# EAGLE design Teensy-FC-BOB (EAGLE 7.4.0)
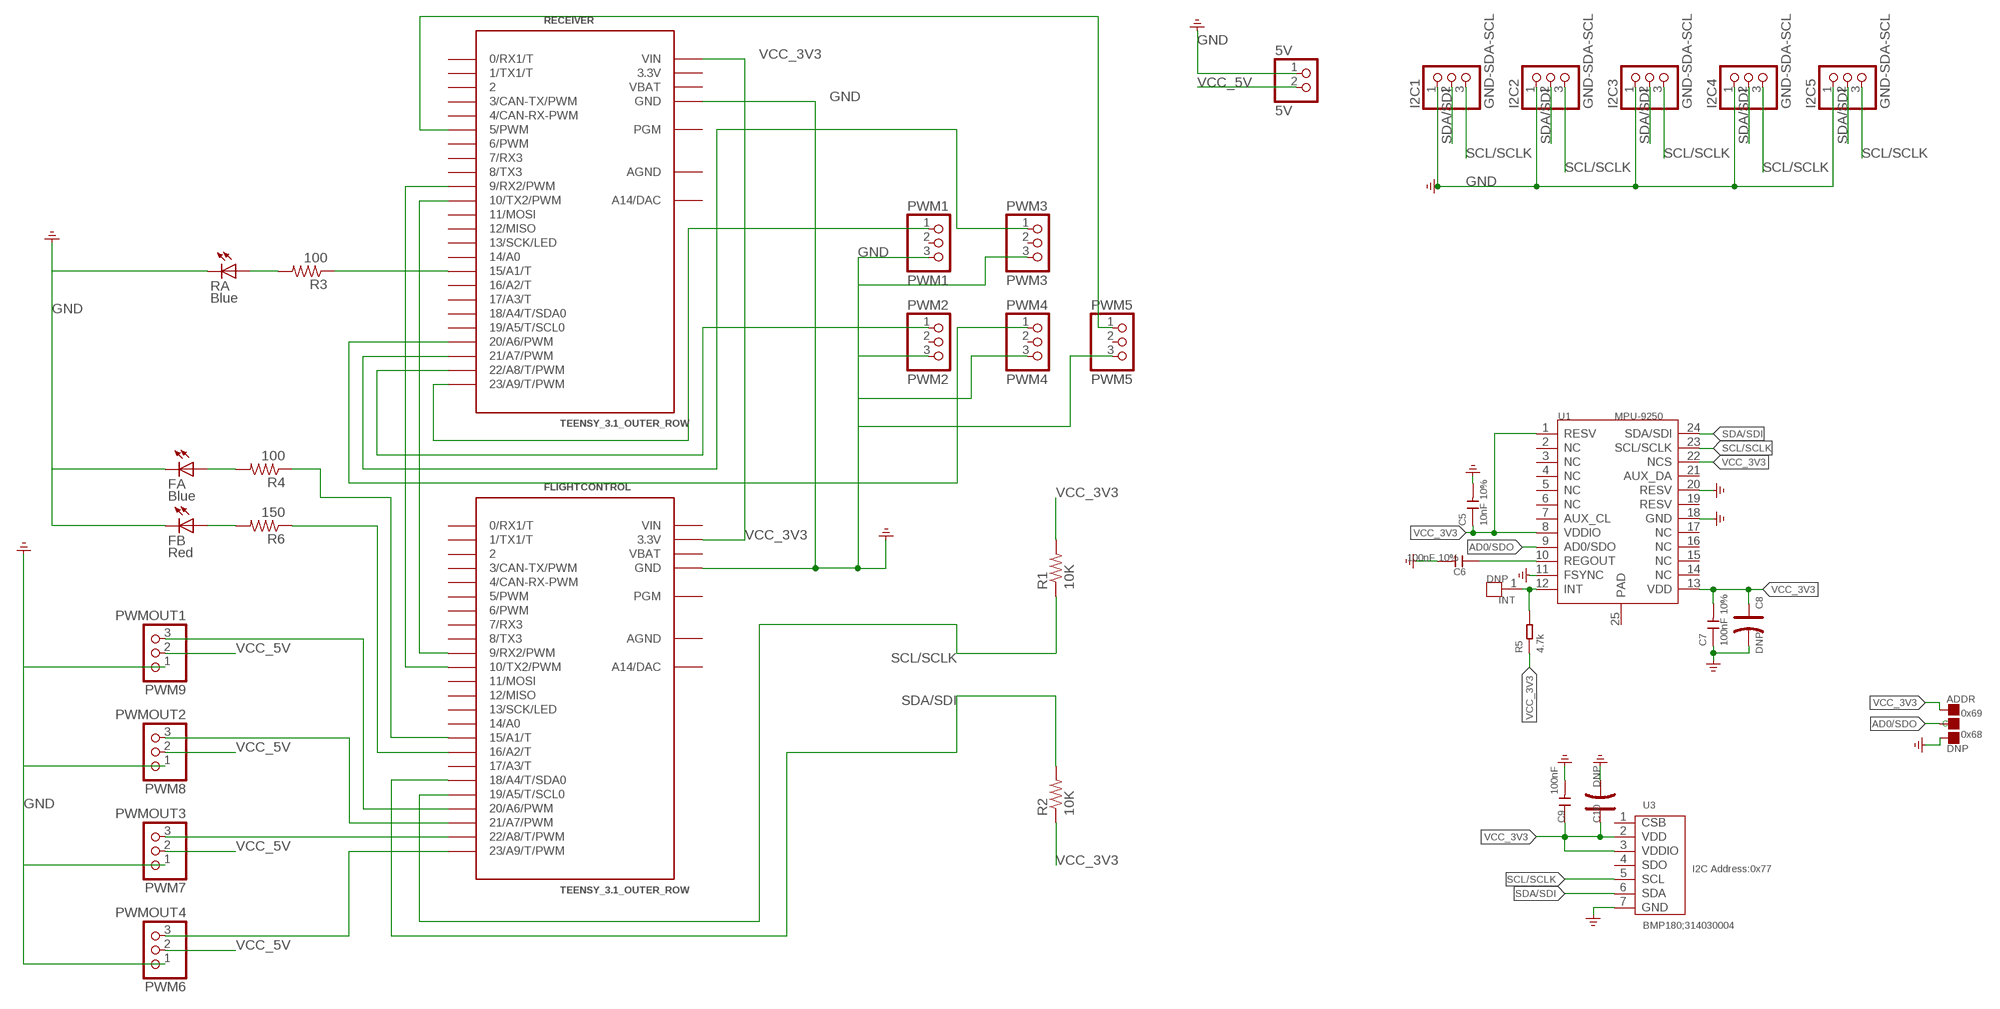
[diagram p0: schematic, sheet 1]

## Parts
5V  5V  PINHD-1X2  [1X02]
ADDR  DNP  PAD-JUMPER-3P-40*40  [3P-SMD-L4.1*W1.5MM]
C5  10nF 10%  CAP-0603  [C0603]
C6  100nF 10%  CAP-0603  [C0603]
C7  100nF 10%  CAP-0603  [C0603]
C8  DNP  CAP-POLAR-AVX-A  [AVX-A]
C9  100nF  CAP-0603  [C0603]
C10  DNP  CAP-POLAR-AVX-A  [AVX-A]
FA  Blue  LEDCHIP-LED0603  [CHIP-LED0603]
FB  Red  LEDCHIP-LED0603  [CHIP-LED0603]
FLIGHTCONTROL  TEENSY_3.1_OUTER_ROW  [TEENSY3-OUTER_ROW]
I2C1  GND-SDA-SCL  PINHD-1X3  [1X03]
I2C2  GND-SDA-SCL  PINHD-1X3  [1X03]
I2C3  GND-SDA-SCL  PINHD-1X3  [1X03]
I2C4  GND-SDA-SCL  PINHD-1X3  [1X03]
I2C5  GND-SDA-SCL  PINHD-1X3  [1X03]
INT  DNP  HEADER-1P-35  [1P-65/35MIL]
PWM1  PWM1  PINHD-1X3  [1X03]
PWM2  PWM2  PINHD-1X3  [1X03]
PWM3  PWM3  PINHD-1X3  [1X03]
PWM4  PWM4  PINHD-1X3  [1X03]
PWM5  PWM5  PINHD-1X3  [1X03]
PWM6  PWMOUT4  PINHD-1X3  [1X03]
PWM7  PWMOUT3  PINHD-1X3  [1X03]
PWM8  PWMOUT2  PINHD-1X3  [1X03]
PWM9  PWMOUT1  PINHD-1X3  [1X03]
R1  10K  R-US_R0603  [R0603]
R2  10K  R-US_R0603  [R0603]
R3  100  R-US_R0603  [R0603]
R4  100  R-US_R0603  [R0603]
R5  4.7k  RES-0603  [R0603]
R6  150  R-US_R0603  [R0603]
RA  Blue  LEDCHIP-LED0603  [CHIP-LED0603]
RECEIVER  TEENSY_3.1_OUTER_ROW  [TEENSY3-OUTER_ROW]
U1  MPU-9250  [LEAD-QFN24]
U3  BMP180;314030004  BMP180  [LGA-7]

## Nets
AD0/SDO: ADDR.MM(C) U1.9(AD0/SDO)
GND: 5V.1 ADDR.11(R) C5.2 C6.2 C7.1 C8.- C9.2 C10.- FA.C FB.C FLIGHTCONTROL.GND FLIGHTCONTROL.GND1(GND) I2C1.1 I2C2.1 I2C3.1 I2C4.1 I2C5.1 PWM1.3 PWM2.3 PWM3.3 PWM4.3 PWM5.3 PWM6.1 PWM7.1 PWM8.1 PWM9.1 RA.C RECEIVER.GND RECEIVER.GND1(GND) U1.11(FSYNC) U1.18(GND) U1.20(RESV) U3.7(GND) ; supply symbol labelled GND_POWER
N$1: FLIGHTCONTROL.9(9/RX2/PWM) RECEIVER.10(10/TX2/PWM)
N$2: FLIGHTCONTROL.10(10/TX2/PWM) RECEIVER.9(9/RX2/PWM)
N$3: C6.1 U1.10(REGOUT)
N$4: INT.1 R5.2 U1.12(INT)
N$5: PWM1.1 RECEIVER.23/A9(23/A9/T/PWM)
N$6: PWM2.1 RECEIVER.22/A8(22/A8/T/PWM)
N$7: PWM3.1 RECEIVER.21/A7(21/A7/PWM)
N$8: PWM4.1 RECEIVER.20/A6(20/A6/PWM)
N$9: PWM5.1 RECEIVER.5(5/PWM)
N$10: FLIGHTCONTROL.20/A6(20/A6/PWM) PWM9.3
N$11: FLIGHTCONTROL.21/A7(21/A7/PWM) PWM8.3
N$12: FLIGHTCONTROL.22/A8(22/A8/T/PWM) PWM7.3
N$13: FLIGHTCONTROL.23/A9(23/A9/T/PWM) PWM6.3
N$14: FLIGHTCONTROL.15/A1(15/A1/T) R4.1
N$15: FA.A R4.2
N$16: R3.1 RECEIVER.15/A1(15/A1/T)
N$17: R3.2 RA.A
N$18: FLIGHTCONTROL.16/A2(16/A2/T) R6.1
N$19: FB.A R6.2
SCL/SCLK: FLIGHTCONTROL.19/A5(19/A5/T/SCL0) I2C1.3 I2C2.3 I2C3.3 I2C4.3 I2C5.3 R1.1 U1.23(SCL/SCLK) U3.5(SCL)
SDA/SDI: FLIGHTCONTROL.18/A4(18/A4/T/SDA0) I2C1.2 I2C2.2 I2C3.2 I2C4.2 I2C5.2 R2.2 U1.24(SDA/SDI) U3.6(SDA)
VCC_3V3: ADDR.00(L) C5.1 C7.2 C8.+ C9.1 C10.+ FLIGHTCONTROL.3.3V FLIGHTCONTROL.3.3V1(3.3V) R1.2 R2.1 R5.1 RECEIVER.VIN U1.1(RESV) U1.8(VDDIO) U1.13(VDD) U1.22(NCS) U3.2(VDD) U3.3(VDDIO)
VCC_5V: 5V.2 PWM6.2 PWM7.2 PWM8.2 PWM9.2
Unconnected: FLIGHTCONTROL.0(0/RX1/T) FLIGHTCONTROL.1(1/TX1/T) FLIGHTCONTROL.2 FLIGHTCONTROL.3(3/CAN-TX/PWM) FLIGHTCONTROL.4(4/CAN-RX-PWM) FLIGHTCONTROL.5(5/PWM) FLIGHTCONTROL.6(6/PWM) FLIGHTCONTROL.7(7/RX3) FLIGHTCONTROL.8(8/TX3) FLIGHTCONTROL.11(11/MOSI) FLIGHTCONTROL.12(12/MISO) FLIGHTCONTROL.13(13/SCK/LED) FLIGHTCONTROL.14/A0 FLIGHTCONTROL.17/A3(17/A3/T) FLIGHTCONTROL.PGM FLIGHTCONTROL.RESET/DAC(A14/DAC) PWM1.2 PWM2.2 PWM3.2 PWM4.2 PWM5.2 RECEIVER.0(0/RX1/T) RECEIVER.1(1/TX1/T) RECEIVER.2 RECEIVER.3(3/CAN-TX/PWM) RECEIVER.4(4/CAN-RX-PWM) RECEIVER.6(6/PWM) RECEIVER.7(7/RX3) RECEIVER.8(8/TX3) RECEIVER.11(11/MOSI) RECEIVER.12(12/MISO) RECEIVER.13(13/SCK/LED) RECEIVER.14/A0 RECEIVER.16/A2(16/A2/T) RECEIVER.17/A3(17/A3/T) RECEIVER.18/A4(18/A4/T/SDA0) RECEIVER.19/A5(19/A5/T/SCL0) RECEIVER.PGM RECEIVER.RESET/DAC(A14/DAC) U1.2(NC) U1.3(NC) U1.4(NC) U1.5(NC) U1.6(NC) U1.7(AUX_CL) U1.14(NC) U1.15(NC) U1.16(NC) U1.17(NC) U1.19(RESV) U1.21(AUX_DA) U1.25(PAD) U3.1(CSB) U3.4(SDO)

## Notes on the sheet
- 0x69
- 0x68
- I2C Address:0x77

## Power pins joined to a net without a drawn wire
3.3V: RECEIVER.3.3V RECEIVER.3.3V1(3.3V)
AGND: FLIGHTCONTROL.AGND RECEIVER.AGND
VBAT: FLIGHTCONTROL.VBAT RECEIVER.VBAT
VIN: FLIGHTCONTROL.VIN

## Library data of the parts
5V = pinhead:PINHD-1X2: PIN HEADER
ADDR = Discrete-new:PAD-JUMPER-3P; PARTNO: DNP
C5-C7 C9 = Discrete-new:CAP: Ceramic Capacitors
C8 C10 = Discrete-new:CAP-POLAR: Electrolytic Capacitors,Tantalum Capacitors and Super Capacitors
FA FB RA = led:LED: LED OSRAM: - CHIPLED LG R971, LG N971, LY N971, LG Q971, LY Q971, LO R971, LY R971 LH N974, LH R974 LS Q976, LO Q976, LY Q976 LO Q996 - Hyper CHIPLED LW Q18S LB Q993, LB Q99A, LB R99A - SideLED LS A670, LO A670, LY A670, LG A670, LP A670 LB A673, LV A673, LT A673, LW A673 LH A674 LY A675 LS A676, LA A676, LO A676, LY A676, LW A676 LS A679, LY A679, LG A679 - Hyper Micro SIDELED® LS Y876, LA Y876, LO Y876, LY Y876 LT Y87S - SmartLED LW L88C, LW L88S LB L89C, LB L89S, LG L890 LS L89K, LO L89K, LY L89K LS L896, LA L896, LO L896, LY L896 - TOPLED LS T670, LO T670, LY T670, LG T670, LP T670 LSG T670, LSP T670, LSY T670, LOP T670, LYG T670 LG T671, LOG T671, LSG T671 LB T673, LV T673, LT T673, LW T673 LH T674 LS T676, LA T676, LO T676, LY T676, LB T676, LH T676, LSB T676, LW T676 LB T67C, LV T67C, LT T67C, LS T67K, LO T67K, LY T67K, LW E67C LS E67B, LA E67B, LO E67B, LY E67B, LB E67C, LV E67C, LT E67C LW T67C LS T679, LY T679, LG T679 LS T770, LO T770, LY T770, LG T770, LP T770 LB T773, LV T773, LT T773, LW T773 LH T774 LS E675, LA E675, LY E675, LS T675 LS T776, LA T776, LO T776, LY T776, LB T776 LHGB T686 LT T68C, LB T68C - Hyper Mini TOPLED® LB M676 - Mini TOPLED Santana® LG M470 LS M47K, LO M47K, LY M47K Source: http://www.osram.convergy.de LUXEON: - LUMILED® LXK2-PW12-R00, LXK2-PW12-S00, LXK2-PW14-U00, LXK2-PW14-V00 LXK2-PM12-R00, LXK2-PM12-S00, LXK2-PM14-U00 LXK2-PE12-Q00, LXK2-PE12-R00, LXK2-PE12-S00, LXK2-PE14-T00, LXK2-PE14-U00 LXK2-PB12-K00, LXK2-PB12-L00, LXK2-PB12-M00, LXK2-PB14-N00, LXK2-PB14-P00, LXK2-PB14-Q00 LXK2-PR12-L00, LXK2-PR12-M00, LXK2-PR14-Q00, LXK2-PR14-R00 LXK2-PD12-Q00, LXK2-PD12-R00, LXK2-PD12-S00 LXK2-PH12-R00, LXK2-PH12-S00 LXK2-PL12-P00, LXK2-PL12-Q00, LXK2-PL12-R00 Source: www.luxeon.com KINGBRIGHT: KA-3528ASYC Source: www.kingbright.com
FLIGHTCONTROL RECEIVER = Teensy_3_and_LC_Series_Boards_v1.0:TEENSY_3.1_OUTER_ROW: Footprint for Teensy 3.1 or 3.2 board using all pin connections on the outer perimeter
I2C1-I2C5 PWM1-PWM9 = pinhead:PINHD-1X3: PIN HEADER
INT = Connector-new:HEADER-1P
R1-R4 R6 = resistor:R-US_: RESISTOR, American symbol
R5 = Discrete-new:RES
U1 = template:MPU-9250
U3 = template:BMP180: Digital pressure sensor

## Board
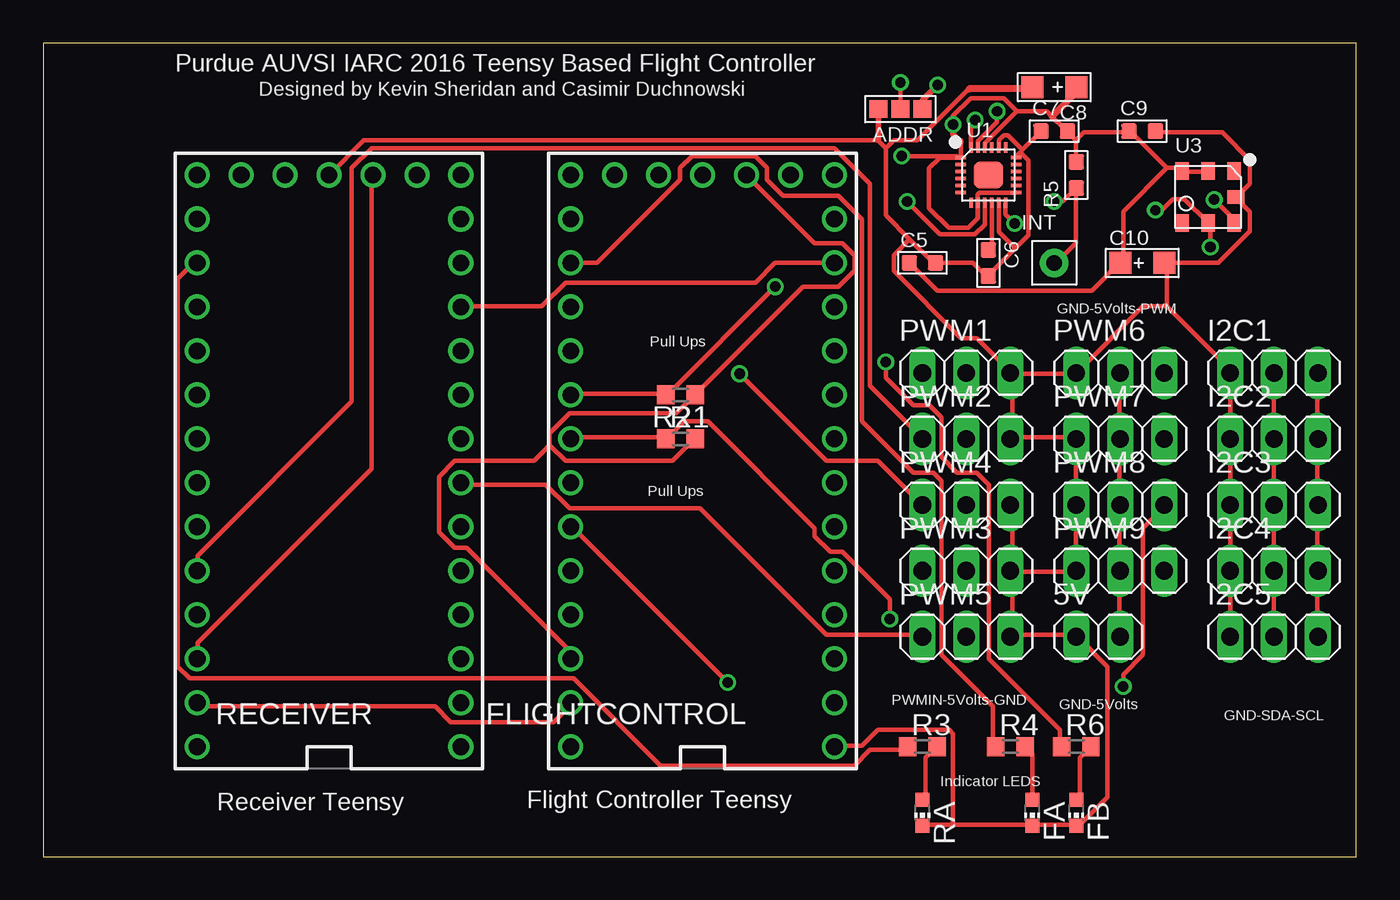
[diagram p1: board, top side]
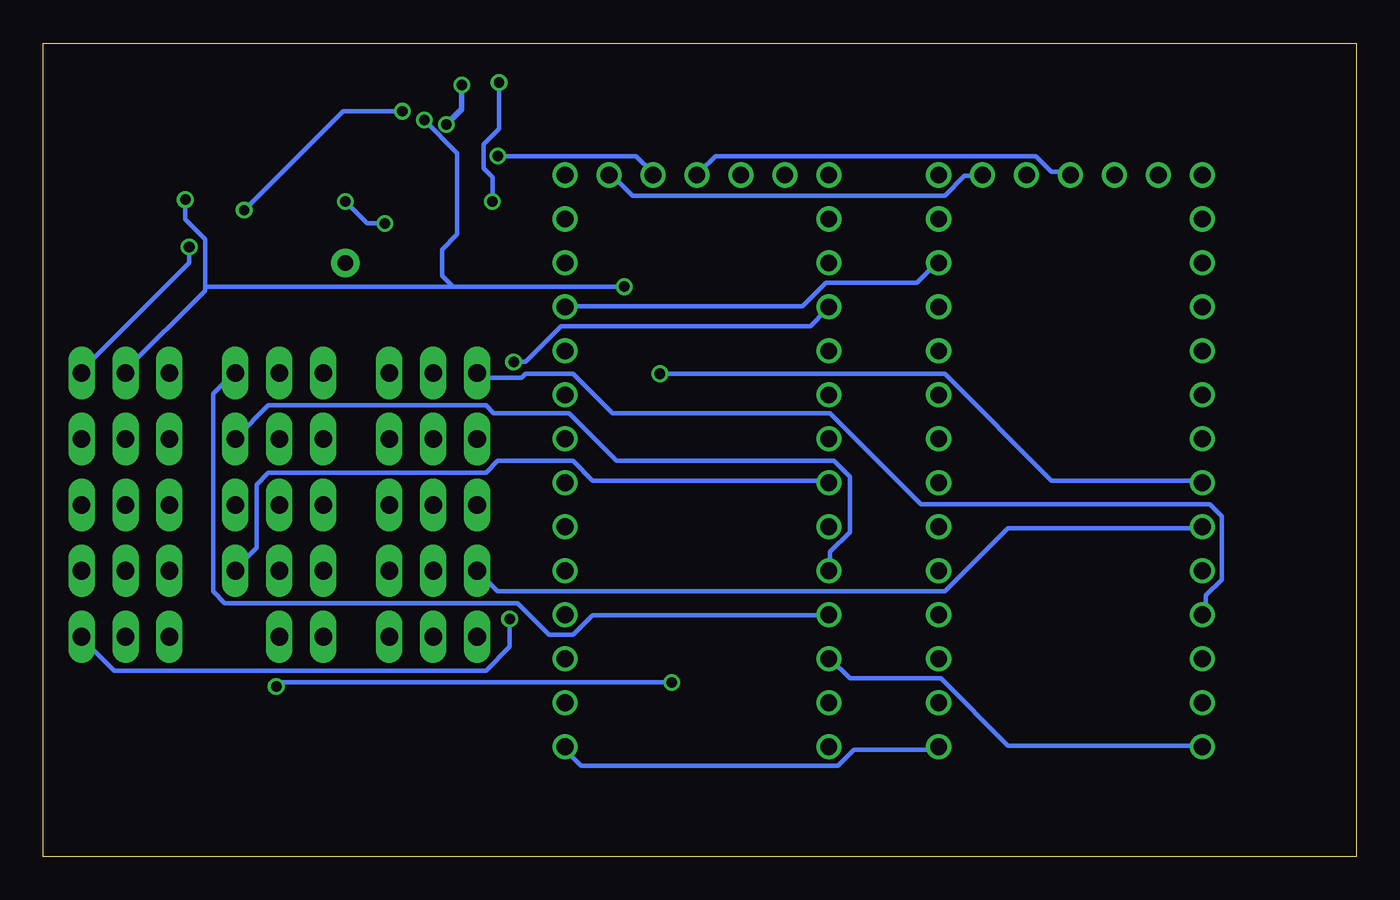
[diagram p2: board, bottom side, seen from below]

Size 75.87 x 46.98 mm. Coordinates in mm from the lower left corner, seen from the top.
Outline: 0,0 75.87,0 75.87,46.98 0,46.98 0,0
Copper layers (1*16): Top 0.0356mm / dielectric 1.5011mm / Bottom 0.0356mm
Design rules "oshpark-2layer": minimum track width 6mil, minimum drill 13mil, track to track 6mil, track to pad 6mil, pad to pad 6mil, via to via 6mil, smd to smd 6mil, copper to edge 15mil, drill to drill 6mil, minimum pad ring 7mil, minimum via ring 7mil, stop-mask expansion 2.5mil, vias tented up to drill 0mil, thermal gap 10mil

### Footprints (pad centres in the part's own frame; a part is rotated, then mirrored left to right if it is on the bottom)
1X02 = drill 1.016 long: 1 -1.27,0; 2 1.27,0
3P-SMD-L4.1*W1.5MM = smd 1.016 x 1.016: 00 -1.27,0; 11 1.27,0; MM 0,0
C0603 = smd 0.889 x 0.889: 1 0,0.762; 2 0,-0.762
AVX-A = smd 1.27 x 1.27: + -1.27,0; - 1.27,0
CHIP-LED0603 = smd 0.8 x 0.8: A 0,-0.75; C 0,0.75
TEENSY3-OUTER_ROW = drill 0.965: 0 -7.62,13.97; 1 -7.62,11.43; 2 -7.62,8.89; 3 -7.62,6.35; 3.3V 7.62,11.43; 3.3V1 -2.54,-16.51; 4 -7.62,3.81; 5 -7.62,1.27; 6 -7.62,-1.27; 7 -7.62,-3.81; 8 -7.62,-6.35; 9 -7.62,-8.89; 10 -7.62,-11.43; 11 -7.62,-13.97; 12 -7.62,-16.51; 13 7.62,-16.51; 14/A0 7.62,-13.97; 15/A1 7.62,-11.43; 16/A2 7.62,-8.89; 17/A3 7.62,-6.35; 18/A4 7.62,-3.81; 19/A5 7.62,-1.27; 20/A6 7.62,1.27; 21/A7 7.62,3.81; 22/A8 7.62,6.35; 23/A9 7.62,8.89; AGND 7.62,13.97; GND -7.62,16.51; GND1 0,-16.51; PGM 2.54,-16.51; RESET/DAC 5.08,-16.51; VBAT -5.08,-16.51; VIN 7.62,16.51
1X03 = drill 1.016 long: 1 -2.54,0; 2 0,0; 3 2.54,0
1P-65/35MIL = drill 0.889 pad 1.651: 1 0,0
R0603 = smd 1 x 1.1: 1 -0.85,0; 2 0.85,0
R0603' = smd 0.889 x 0.889: 1 0,0.762; 2 0,-0.762
LEAD-QFN24 = smd 0.6 x 0.2: 1 -1.6,1; 2 -1.6,0.6; 3 -1.6,0.2; 4 -1.6,-0.2; 5 -1.6,-0.6; 6 -1.6,-1; 13 1.6,-1; 14 1.6,-0.6; 15 1.6,-0.2; 16 1.6,0.2; 17 1.6,0.6; 18 1.6,1 | smd 0.2 x 0.6: 7 -1,-1.6; 8 -0.6,-1.6; 9 -0.2,-1.6; 10 0.2,-1.6; 11 0.6,-1.6; 12 1,-1.6; 19 1,1.6; 20 0.6,1.6; 21 0.2,1.6; 22 -0.2,1.6; 23 -0.6,1.6; 24 -1,1.6 | smd 1.7 x 1.54: 25 0,0
LGA-7 = smd 0.8 x 1: 1 1.5,1.5; 2 0,1.5; 3 -1.5,1.5; 4 -1.5,-1.5; 5 0,-1.5; 6 1.5,-1.5 | smd 1 x 0.8: 7 1.6,0

### Placement (x,y rotation side)
5V  60.96,12.7 0 top
ADDR  49.53,43.18 180 top
C5  50.8,34.29 90 top
C6  54.61,34.29 0 top
C7  58.42,41.91 90 top
C8  58.42,44.45 180 top
C9  63.5,41.91 90 top
C10  63.5,34.29 0 top
FA  57.15,2.54 180 top
FB  59.69,2.54 180 top
FLIGHTCONTROL  38.1,22.86 180 top
I2C1  71.12,27.94 0 top
I2C2  71.12,24.13 0 top
I2C3  71.12,20.32 0 top
I2C4  71.12,16.51 0 top
I2C5  71.12,12.7 0 top
INT  58.42,34.29 0 top
PWM1  53.34,27.94 0 top
PWM2  53.34,24.13 0 top
PWM3  53.34,16.51 0 top
PWM4  53.34,20.32 0 top
PWM5  53.34,12.7 0 top
PWM6  62.23,27.94 0 top
PWM7  62.23,24.13 0 top
PWM8  62.23,20.32 0 top
PWM9  62.23,16.51 0 top
R1  36.83,24.13 0 top
R2  36.83,26.67 180 top
R3  50.8,6.35 0 top
R4  55.88,6.35 0 top
R5  4.7k  [R0603']  59.69,39.37 0 top
R6  59.69,6.35 0 top
RA  50.8,2.54 180 top
RECEIVER  16.51,22.86 180 top
U1  54.61,39.37 0 top
U3  67.31,38.1 0 top

### Tracks (layer width: path | path; a pad name or v marks a point on that pad's centre or on a via)
3.3V
  Top 0.254: RECEIVER.3.3V 8.91,11.43 8.91,12.34 18.97,22.4 18.97,39.32 RECEIVER.3.3V1
AD0/SDO  (via drill 0.6)
  Top 0.254: U1.9 54.41,36.5 53.85,35.94 51.82,35.94 v49.91,37.85 | v49.53,44.7 ADDR.MM
  Bottom 0.254: v49.91,37.85 49.91,39.24 50.42,39.75 50.42,41.15 49.53,42.04 v49.53,44.7
AGND
  Top 0.254: RECEIVER.AGND 8.91,8.69 22.63,8.69 23.55,7.77 29.49,7.77 30.4,8.69 FLIGHTCONTROL.AGND
GND
  Top 0.254: I2C5.1 I2C4.1 I2C3.1 I2C2.1 I2C1.1 68.58,28.12 64.92,31.77 | C9.2 64.47,41.83 68.12,41.83 69.72,40.23 69.72,38.86 69.04,38.18 U3.7 69.04,37.95 69.72,37.26 69.72,36.12 67.89,34.29 64.92,34.29 | 64.92,31.77 64.92,34.29 | 64.92,34.29 C10.- | 56.59,40.82 57.61,41.83 C7.1 | 56.59,40.82 56.46,40.69 | 56.46,40.69 56.24,40.46 U1.18 | 53.49,44.35 50.52,41.38 49.15,41.38 48.69,40.92 | 48.69,40.92 48.69,37.03 50.06,35.66 | 50.06,35.66 51.44,34.29 C5.2 53.72,34.29 54.41,33.6 C6.2 54.63,33.6 56.17,35.14 | 57.15,44.35 C8.- | 56.46,40.69 56.92,40.23 56.92,35.89 56.17,35.14 | 56.01,27.89 56.01,24.23 | 56.01,24.23 59.66,24.23 PWM7.1 59.66,24 59.66,20.34 PWM8.1 59.66,20.12 59.66,16.69 PWM9.1 59.66,16.46 56.01,16.46 | 56.01,24.23 PWM2.3 | 56.01,27.89 59.66,27.89 PWM6.1 59.89,28.12 63.55,31.77 64.92,31.77 | 56.01,27.89 PWM1.3 55.78,28.12 53.95,29.95 53.03,29.95 49.15,33.83 49.15,34.75 50.06,35.66 | 57.15,1.83 52.58,1.83 | 52.58,1.83 50.98,1.83 RA.C | 57.15,1.83 59.66,1.83 FB.C 59.89,1.83 61.49,3.43 61.49,10.97 59.89,12.57 5V.1 59.66,12.8 56.01,12.8 | 57.15,1.83 FA.C | 56.01,16.46 56.01,12.8 | 56.01,12.8 PWM5.3 | PWM4.3 56.01,20.12 56.01,16.69 PWM3.3 56.01,16.46 | 52.58,1.83 52.58,7.09 52.35,7.32 48.23,7.32 47.32,6.4 45.72,6.4 FLIGHTCONTROL.GND | RECEIVER.GND1 18.52,41.38 48.23,41.38 48.69,40.92 | U1.20 55.21,41.37 55.5,41.66 55.75,41.66 56.59,40.82 | U1.11 55.21,36.1 56.17,35.14
  Top 0.305: ADDR.11 48.26,41.4 48.23,41.38
  Top 0.406: 57.15,44.35 53.49,44.35
  Bottom 0.254: RECEIVER.GND1 16.69,39.55 17.6,39.55 18.52,40.46 37.03,40.46 37.95,39.55 FLIGHTCONTROL.GND1 | RECEIVER.GND 24.23,6.17 29.03,6.17 29.95,5.26 44.81,5.26 45.72,6.17 FLIGHTCONTROL.GND
N$1
  Bottom 0.254: FLIGHTCONTROL.9 45.72,31.77 32,31.77 30.63,33.15 25.38,33.15 24.23,34.29 RECEIVER.10
N$2
  Top 0.254: FLIGHTCONTROL.10 42.29,34.29 41.15,33.15 30.18,33.15 28.8,31.77 24.23,31.77 RECEIVER.9
N$3
  Top 0.254: U1.10 54.81,35.25 C6.1
N$4  (via drill 0.6)
  Top 0.254: INT.1 58.52,34.29 59.66,35.43 59.66,38.41 R5.2 58.93,37.85 v58.42,37.85 | U1.12 55.61,37.1 v56.13,36.58
  Bottom 0.254: v56.13,36.58 57.15,36.58 v58.42,37.85
N$5
  Bottom 0.254: PWM1.1 50.52,27.66 48.23,27.66 48.01,27.89 45.26,27.89 42.98,25.6 30.4,25.6 25.15,20.34 8.46,20.34 7.77,19.66 7.77,16 8.69,15.09 8.69,14.17 RECEIVER.23/A9
N$6
  Top 0.254: RECEIVER.22/A8 8.91,16.69 8.91,17.37 17.83,26.29 17.83,39.78 18.97,40.92 45.72,40.92 47.78,38.86 47.78,27.2 50.75,24.23 PWM2.1
N$7
  Bottom 0.254: PWM3.1 49.61,15.32 23.77,15.32 20.12,18.97 8.91,18.97 RECEIVER.21/A7
N$8  (via drill 0.61)
  Top 0.254: v40.23,27.89 45.26,22.86 48.23,22.86 50.75,20.34 PWM4.1
  Bottom 0.254: v40.23,27.89 23.77,27.89 17.6,21.72 8.91,21.72 RECEIVER.20/A6
N$9
  Top 0.254: RECEIVER.5 24.23,21.49 29.03,21.49 30.4,20.12 37.95,20.12 45.26,12.8 50.75,12.8 PWM5.1
N$10
  Bottom 0.254: FLIGHTCONTROL.20/A6 30.63,21.72 44.12,21.72 45.26,22.86 49.61,22.86 50.29,22.17 62.87,22.17 63.55,21.49 63.55,17.83 64.69,16.69 PWM9.3
N$11  (via drill 0.61)
  Top 0.254: v39.55,10.06 30.63,18.97 FLIGHTCONTROL.21/A7 | v62.41,9.83 62.41,10.52 63.55,11.66 63.55,18.97 64.69,20.12 PWM8.3
  Bottom 0.254: v39.55,10.06 62.18,10.06 v62.41,9.83
N$12
  Bottom 0.254: FLIGHTCONTROL.22/A8 30.4,16.69 30.4,17.6 29.26,18.75 29.26,21.95 30.18,22.86 42.75,22.86 45.49,25.6 49.84,25.6 50.29,26.06 62.87,26.06 64.69,24.23 PWM7.3
N$13
  Bottom 0.254: FLIGHTCONTROL.23/A9 30.63,13.95 44.12,13.95 45.26,12.8 46.63,12.8 48.46,14.63 65.38,14.63 66.06,15.32 66.06,26.75 64.92,27.89 PWM6.3
N$14
  Top 0.254: FLIGHTCONTROL.15/A1 32,34.29 36.8,39.09 36.8,39.78 37.49,40.46 41.15,40.46 41.83,39.78 41.83,39.09 42.75,38.18 45.95,38.18 47.32,36.8 47.32,25.15 50.29,22.17 51.44,22.17 51.89,21.72 51.89,11.66 54.86,8.69 54.86,6.4 R4.1
N$15
  Top 0.254: FA.A 57.15,5.94 56.92,6.17 R4.2
N$16
  Top 0.254: R3.1 49.84,6.17 47.78,6.17 46.86,5.26 35.66,5.26 30.63,10.29 8.46,10.29 7.77,10.97 7.77,33.38 8.69,34.29 RECEIVER.15/A1
N$17
  Top 0.254: RA.A 50.98,3.43 50.98,5.71 51.44,6.17 R3.2
N$18  (via drill 0.61)
  Top 0.254: v48.69,28.57 48.69,27.66 50.29,26.06 51.21,26.06 51.89,25.38 51.89,23.09 52.81,22.17 53.95,22.17 54.63,21.49 54.63,11.43 58.75,7.32 58.75,6.4 R6.1
  Bottom 0.254: v48.69,28.57 48.01,28.57 45.95,30.63 31.55,30.63 30.63,31.55 FLIGHTCONTROL.16/A2
N$19
  Top 0.254: FB.A 59.89,3.43 59.89,5.71 60.35,6.17 R6.2
SCL/SCLK  (via drill 0.6, 0.61)
  Top 0.254: v67.44,35.2 67.44,36.58 U3.5 65.94,37.97 65.28,37.97 64.64,37.34 v64.26,37.34 | I2C1.3 73.61,27.89 73.61,24.23 I2C2.3 73.61,24 73.61,20.34 I2C3.3 73.61,20.12 73.61,16.69 I2C4.3 73.61,16.46 73.61,12.8 I2C5.3 | FLIGHTCONTROL.19/A5 30.63,24.23 35.89,24.23 R1.1 36.12,24.23 37.03,25.15 38.41,25.15 44.58,18.97 44.58,18.52 45.49,17.6 46.18,17.6 48.92,14.86 v48.92,13.72 | U1.23 54.01,41.31 55.12,42.42 v55.12,43.05
  Bottom 0.254: v67.44,35.2 67.44,34.29 73.61,28.12 I2C1.3 | v48.92,13.72 48.92,12.12 50.29,10.74 71.78,10.74 73.61,12.57 I2C5.3 | v55.12,43.05 58.55,43.05 v64.26,37.34
SDA/SDI  (via drill 0.6, 0.61)
  Top 0.254: I2C5.2 71.09,12.8 71.09,16.46 I2C4.2 71.09,16.69 71.09,20.12 I2C3.2 71.09,20.34 71.09,24 I2C2.2 71.09,24.23 71.09,27.89 I2C1.2 | FLIGHTCONTROL.18/A4 30.63,26.75 35.89,26.75 R2.2 36.12,26.75 v42.29,32.92 | v67.67,37.95 68.81,36.8 U3.6 | U1.24 53.61,42.31 v53.85,42.55
  Bottom 0.254: v67.67,37.95 67.67,36.8 66.52,35.66 66.52,32.92 | 66.52,32.92 66.52,32.69 71.09,28.12 I2C1.2 | 66.52,32.92 52.2,32.92 | 52.2,32.92 v42.29,32.92 | v53.85,42.55 51.94,40.64 51.94,35.94 52.83,35.05 52.83,33.55 52.2,32.92
VBAT
  Bottom 0.254: RECEIVER.VBAT 21.72,39.32 22.63,39.32 23.77,38.18 41.83,38.18 42.98,39.32 FLIGHTCONTROL.VBAT
VCC_3V3  (via drill 0.6, 0.61)
  Top 0.254: C5.1 50.06,34.29 51.66,32.69 60.58,32.69 62.18,34.29 C10.+ 62.41,34.29 62.41,37.26 64.92,39.78 | U3.2 67.21,39.55 65.84,39.55 U3.3 65.61,39.78 64.92,39.78 | 53.03,41.38 53.03,41.27 | 53.03,41.27 53.03,40.46 U1.1 | 59.66,41.38 59.66,40.23 R5.1 | 59.66,41.38 59.21,41.83 C7.2 58.98,42.06 58.29,42.75 57.99,43.05 56.26,43.05 | 59.66,41.38 60.12,41.83 62.64,41.83 C9.1 62.87,41.83 64.92,39.78 | 59.66,44.35 C8.+ | 29.26,23.77 30.18,22.86 36.35,22.86 37.49,24 R1.2 | 29.26,23.77 29.26,24.46 30.4,25.6 36.58,25.6 37.49,26.52 R2.1 37.72,26.75 43.89,32.92 45.95,32.92 46.86,33.83 46.86,34.75 46.18,35.43 44.58,35.43 FLIGHTCONTROL.3.3V1 | v49.61,40.46 52.81,40.46 U1.1 | 29.26,23.77 28.35,22.86 23.77,22.86 22.86,21.95 22.86,18.75 23.77,17.83 24.46,17.83 30.4,11.89 30.4,11.43 FLIGHTCONTROL.3.3V | U1.1 51.8,40.37 51.18,39.75 51.18,37.47 52.32,36.32 53.47,36.32 53.98,36.83 | 53.98,36.83 53.98,37.73 | 53.98,37.73 U1.8 54.01,36.87 53.98,36.83 | U1.22 54.41,41.2 56.26,43.05 | 53.03,41.27 52.96,41.27 52.58,41.66 v52.58,42.29 52.58,42.8 53.59,43.81 55.5,43.81 56.26,43.05 | 53.98,37.73 53.98,38.23 54.1,38.35 56.19,38.35 U1.13
  Top 0.305: ADDR.00 50.8,43.69 v51.69,44.58 | v52.58,42.29 52.58,41.73 53.03,41.27
  Top 0.406: 59.66,44.35 59.66,44.12 58.29,42.75
  Bottom 0.254: RECEIVER.VIN 8.91,6.4 20.12,6.4 24,10.29 29.26,10.29 30.4,11.43 FLIGHTCONTROL.3.3V | v49.61,40.46 41.6,40.46 40.69,39.55 FLIGHTCONTROL.3.3V1
  Bottom 0.305: v51.69,44.58 51.69,43.18 v52.58,42.29
VCC_5V
  Top 0.254: PWM6.2 62.18,27.89 62.18,24.23 PWM7.2 62.18,24 62.18,20.34 PWM8.2 62.18,20.12 62.18,16.69 PWM9.2 62.18,16.46 62.18,12.8 5V.2

### Text on the board
tNames: Purdue AUVSI IARC 2016 Teensy Based Flight Controller | Designed by Kevin Sheridan and Casimir Duchnowski | GND-5Volts-PWM | Pull Ups | Pull Ups | PWMIN-5Volts-GND | GND-5Volts | GND-SDA-SCL | Indicator LEDS | Receiver Teensy | Flight Controller Teensy